# Altium project Main_Board.PrjPcb
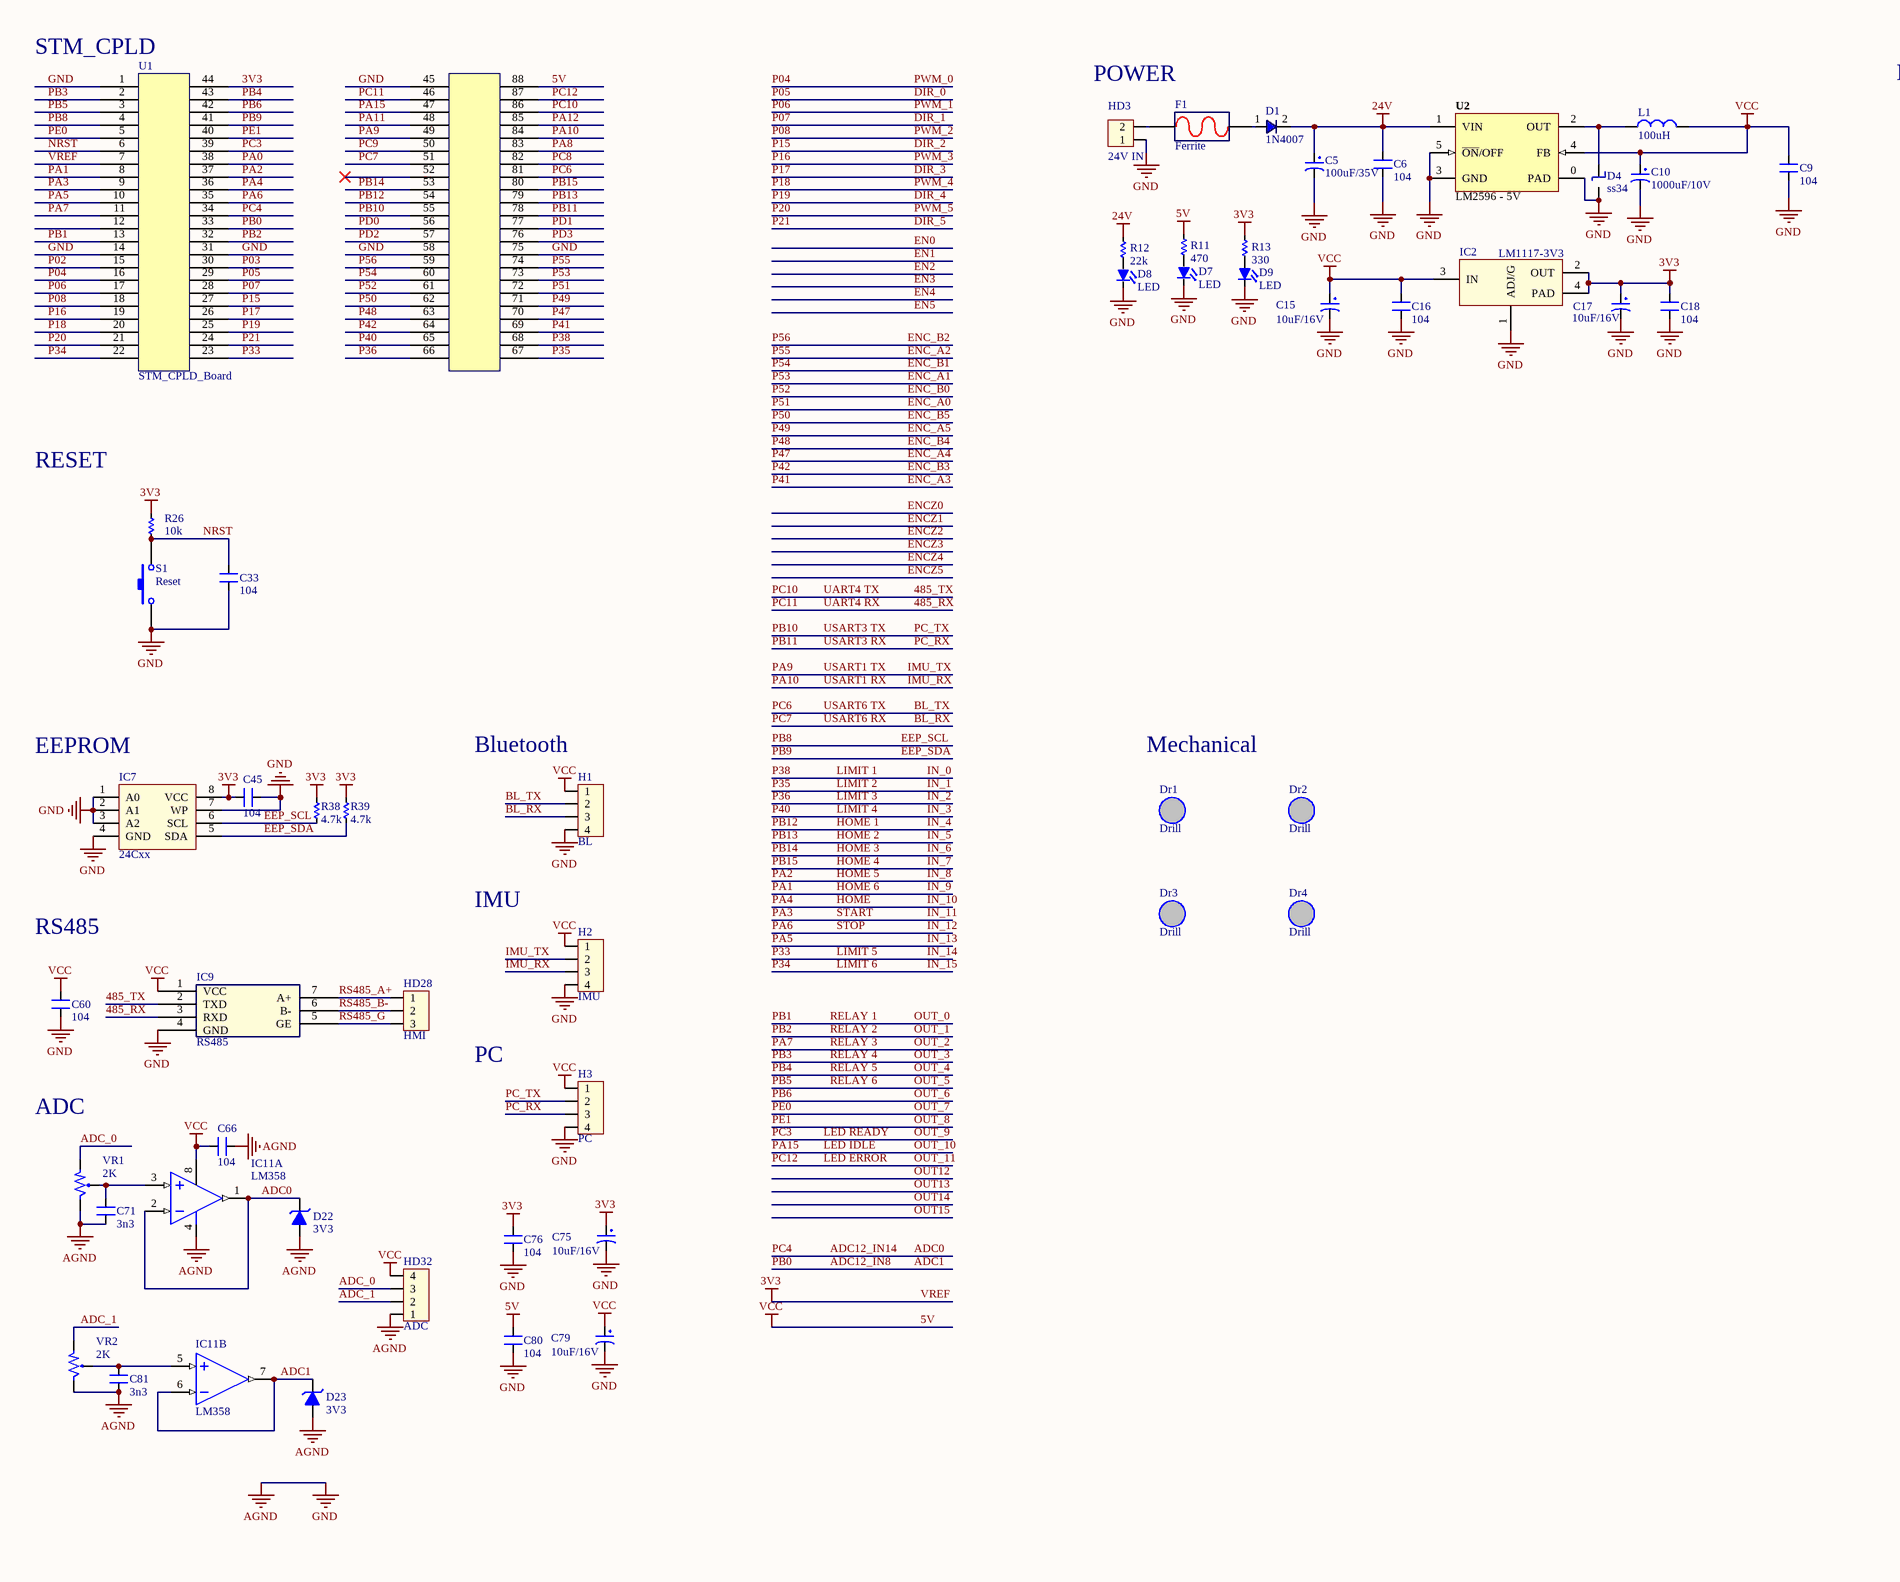
[diagram p0: Main_Board.SchDoc, top left]
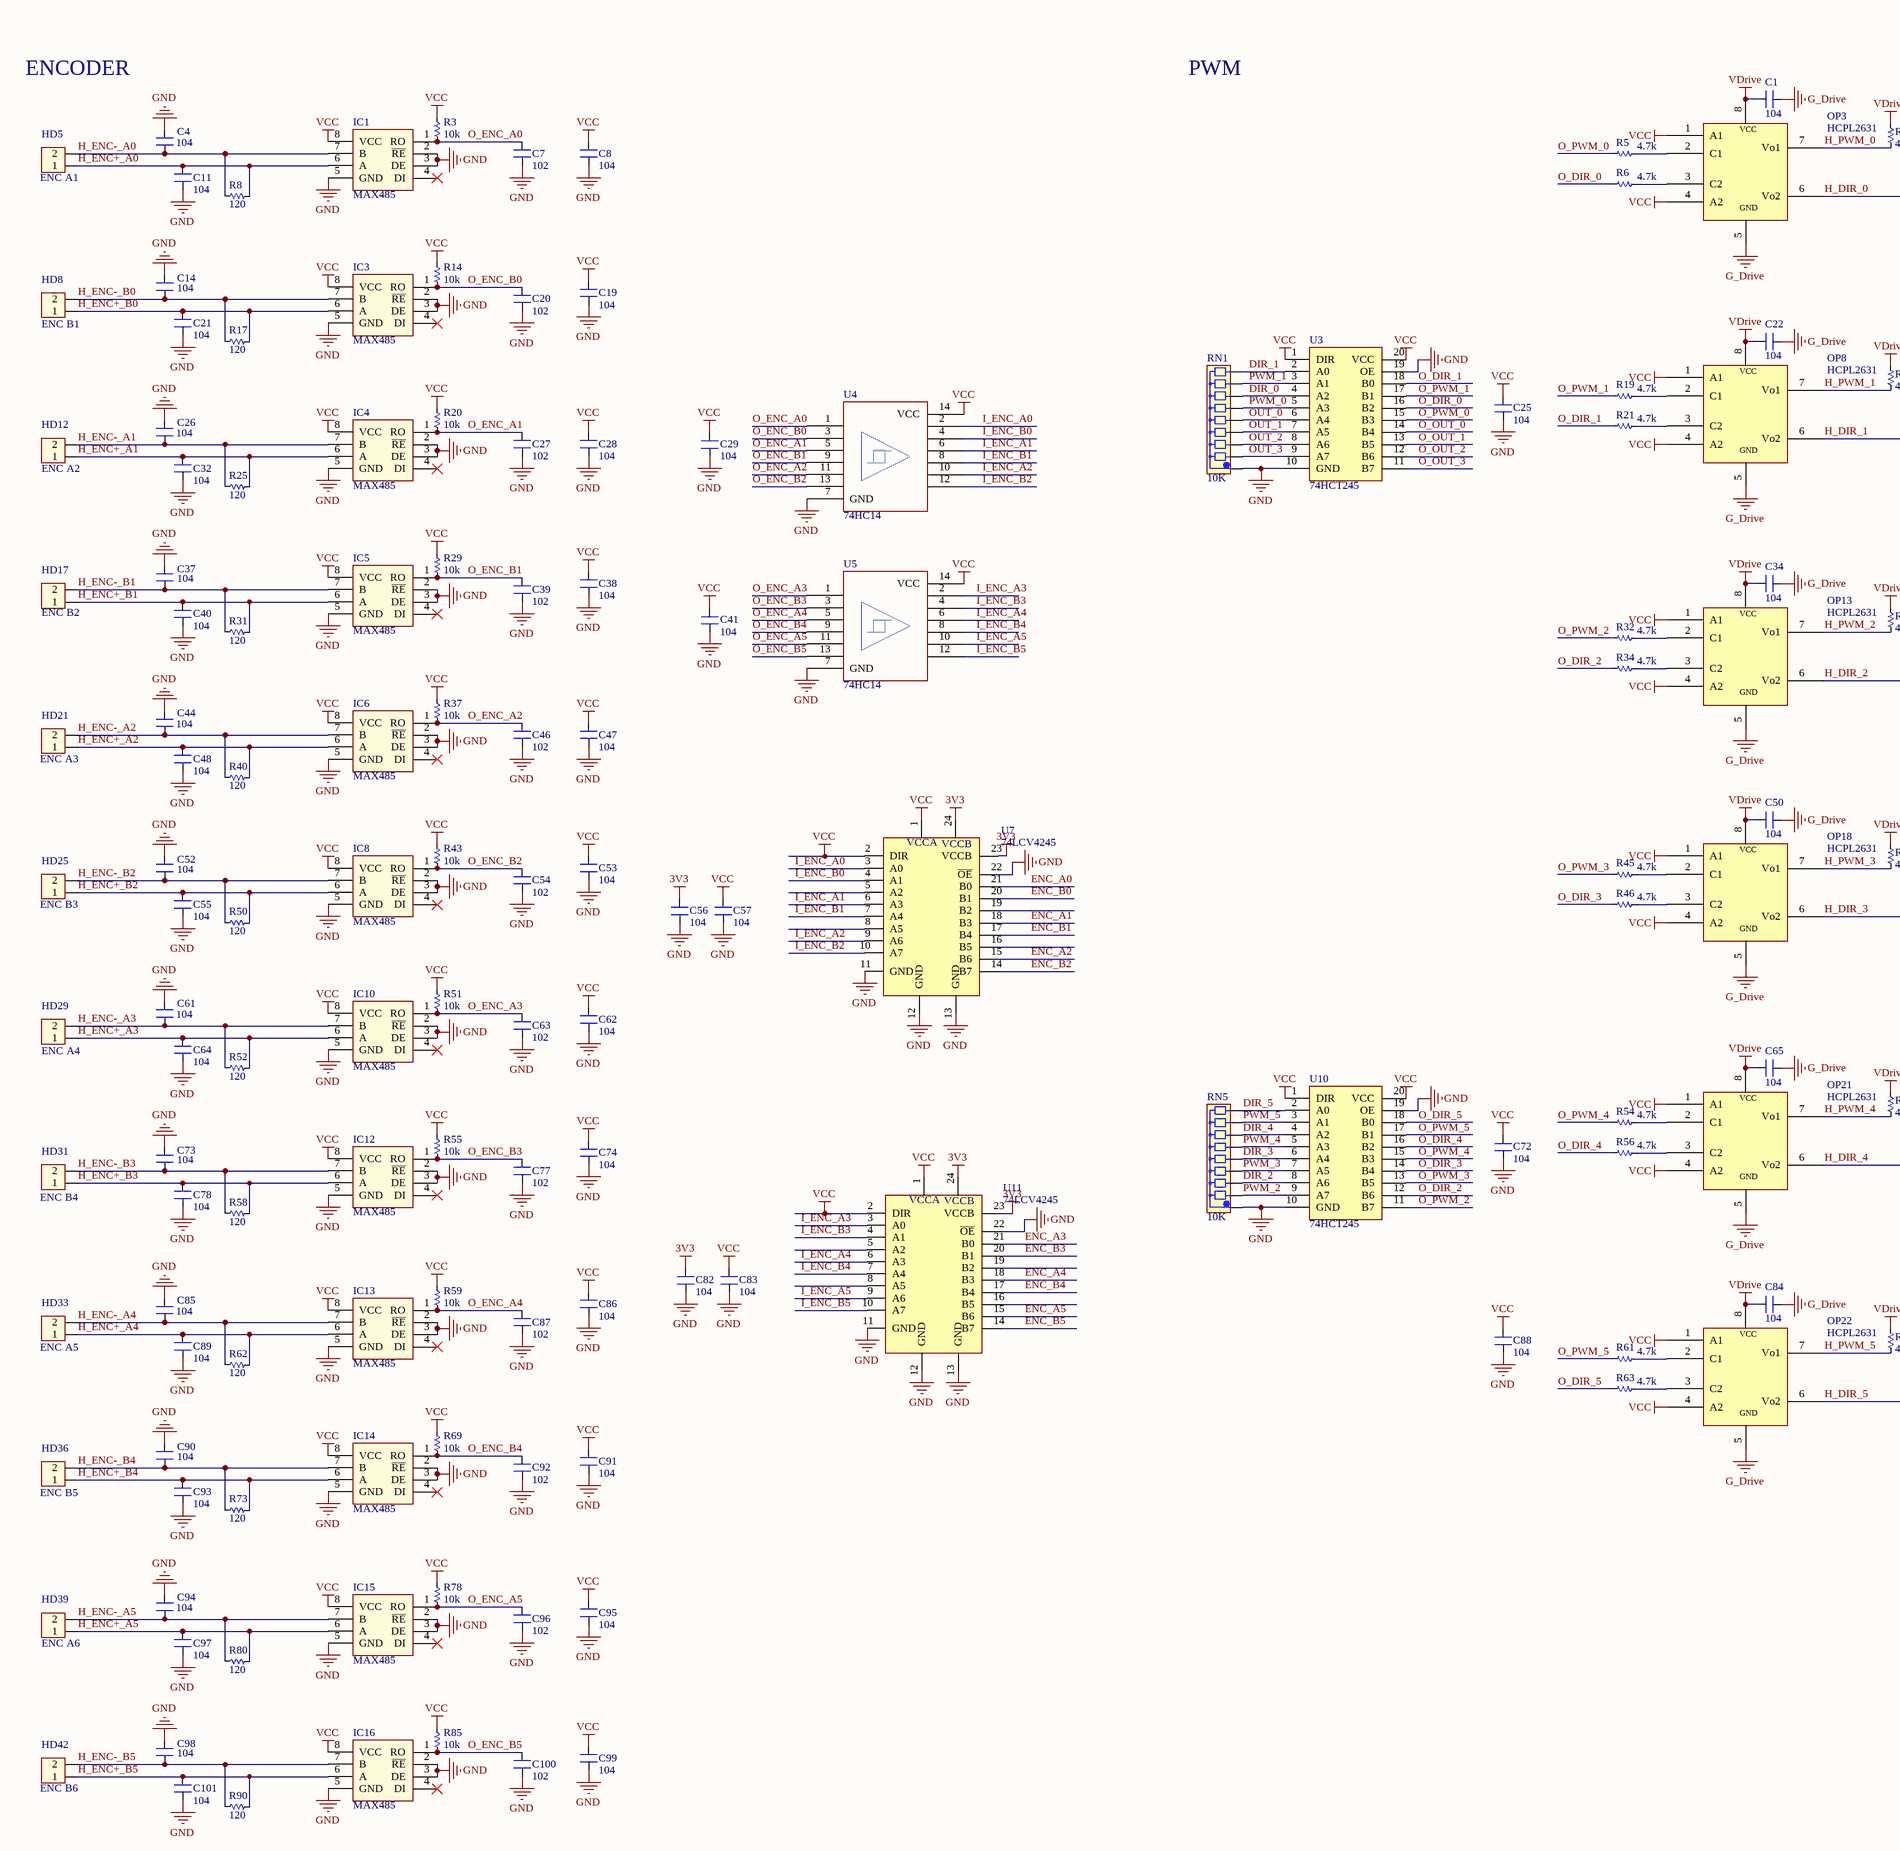
[diagram p1: Main_Board.SchDoc, top middle]
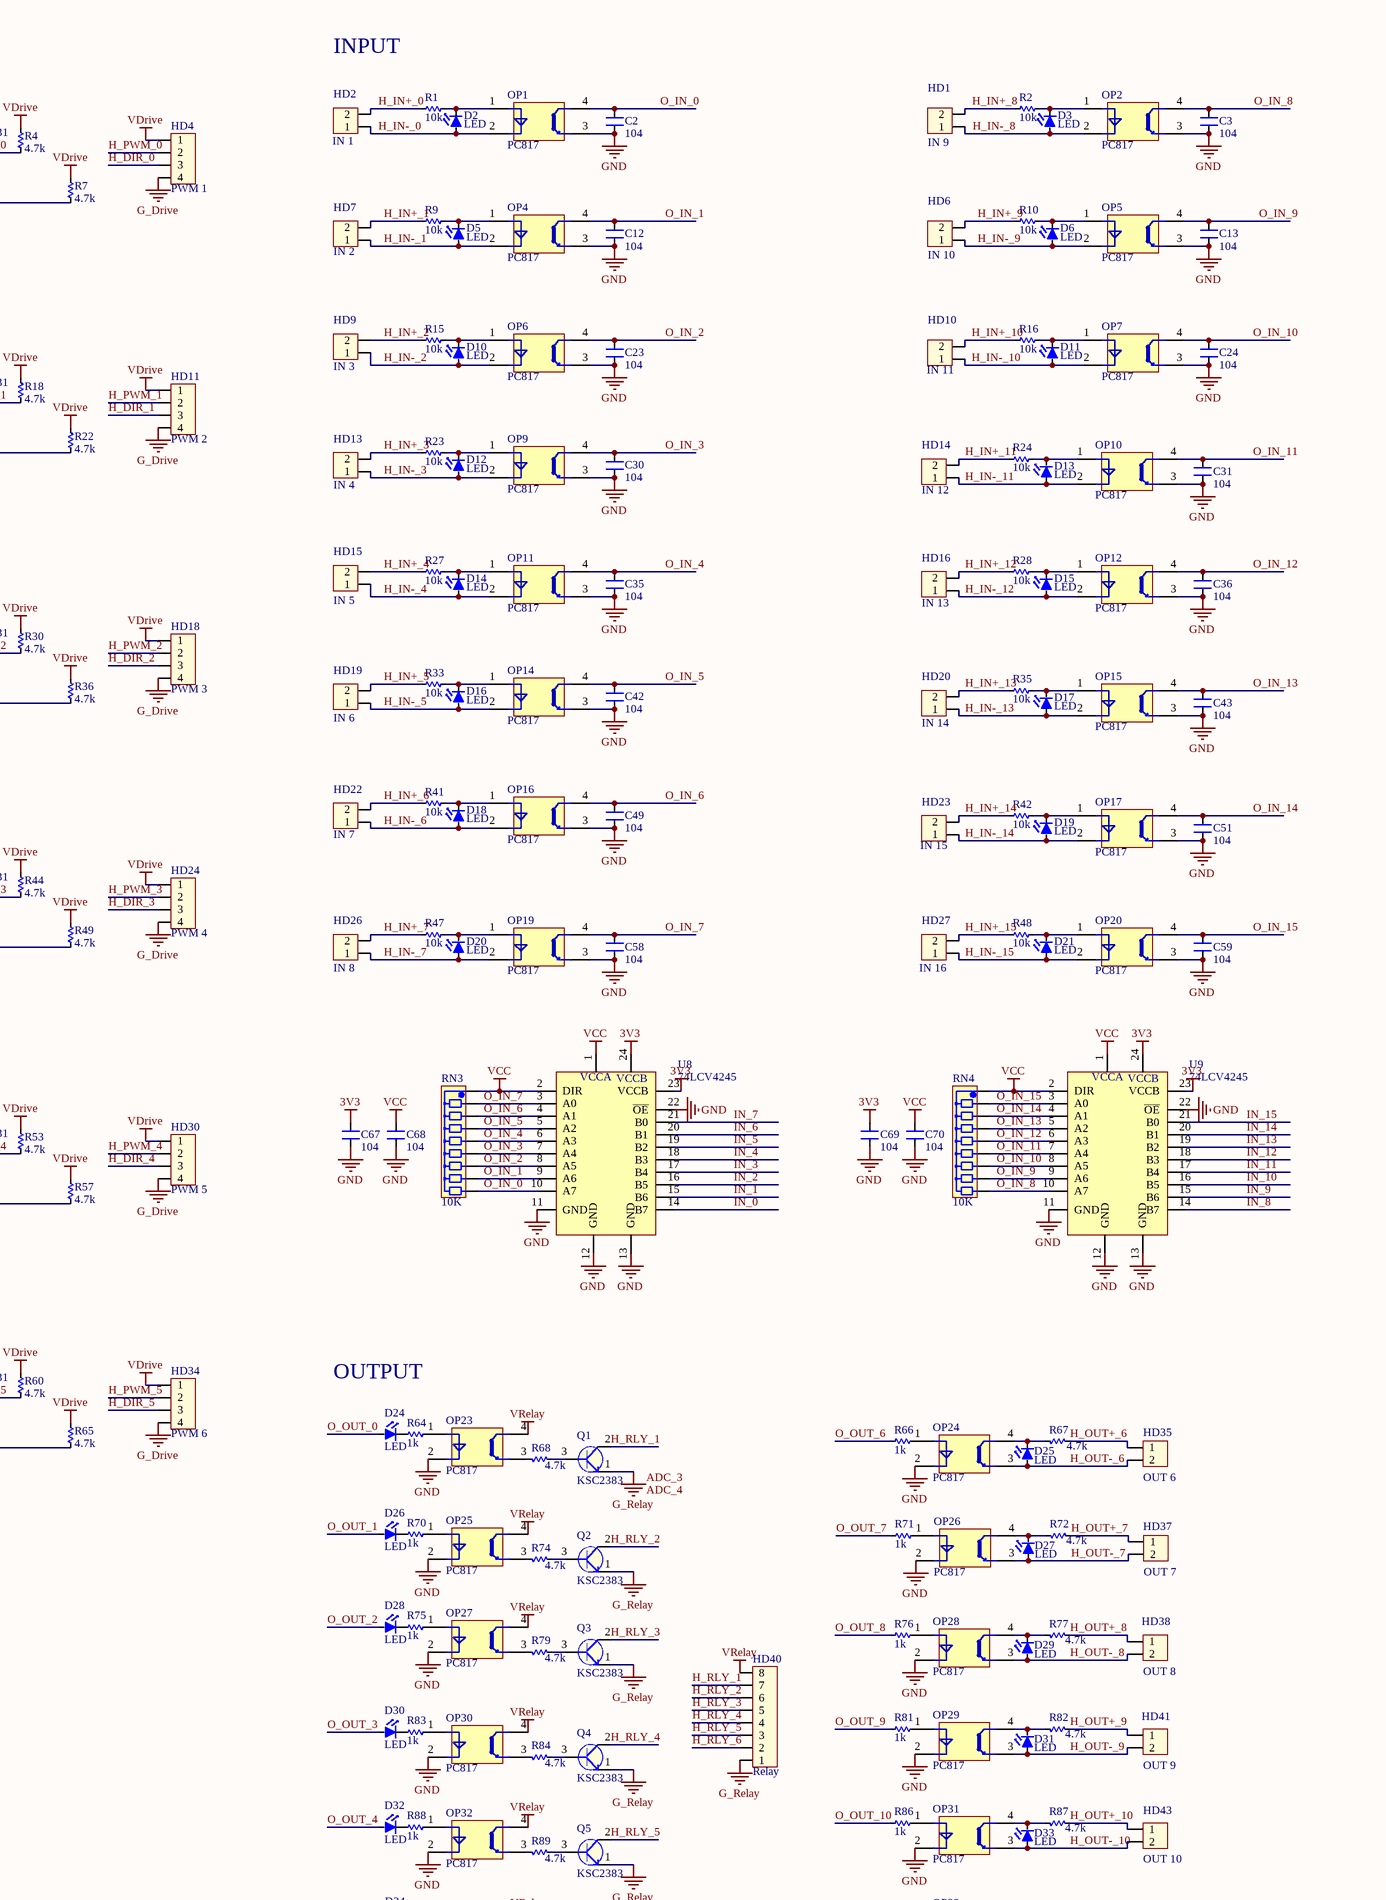
[diagram p2: Main_Board.SchDoc, top right]
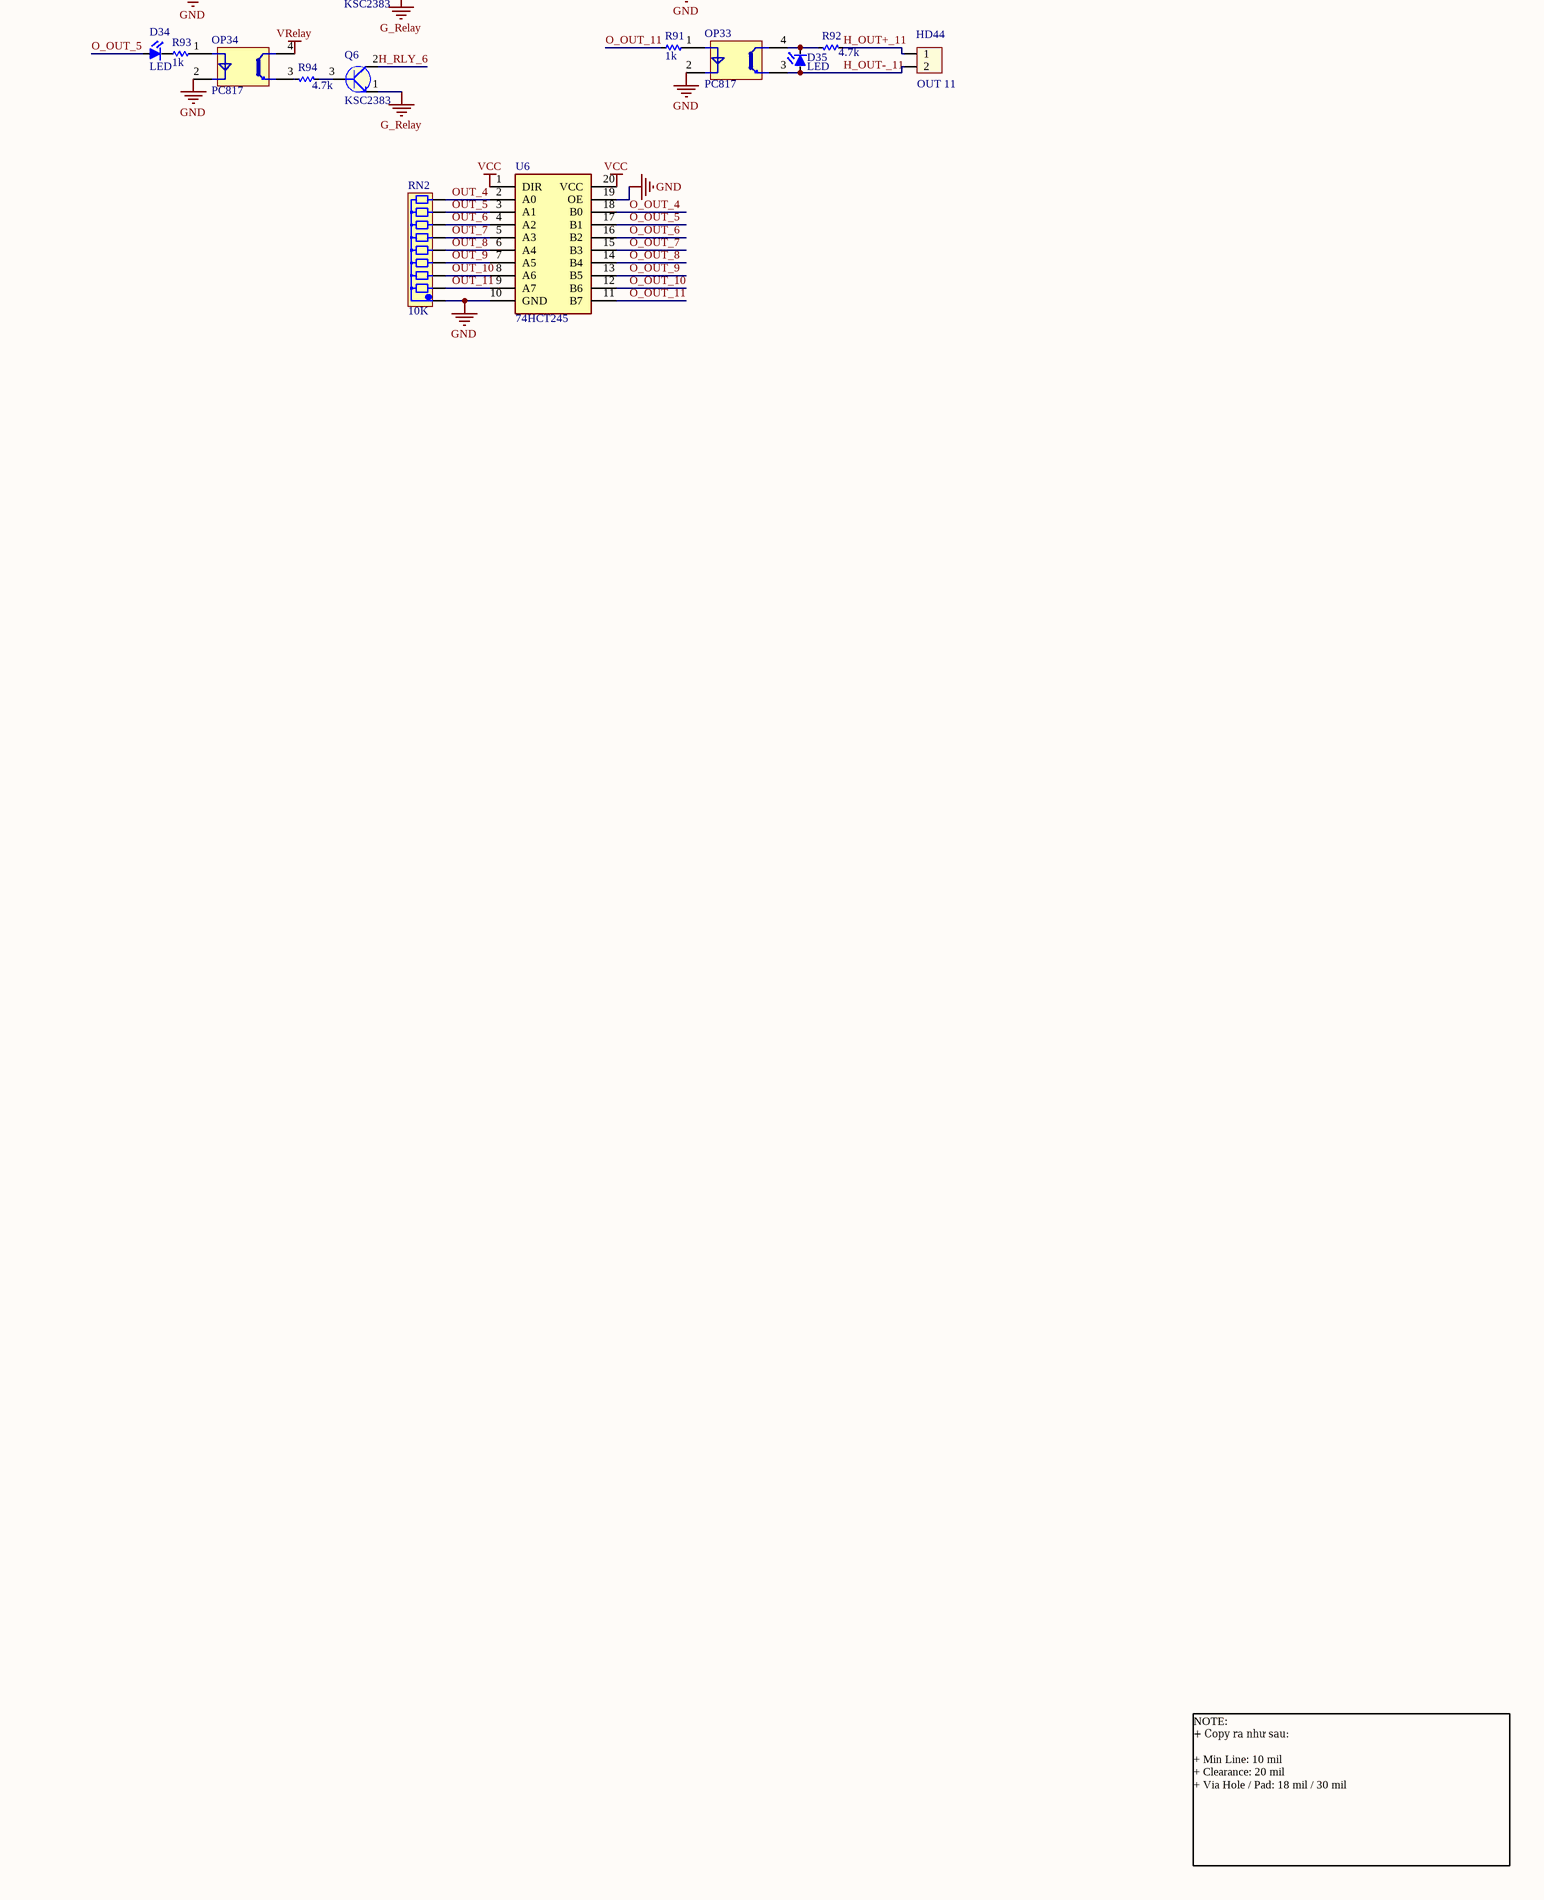
[diagram p3: Main_Board.SchDoc, bottom right]
1 sheet, 358 parts. Net scope: global (net labels, ports and power ports of the same name join across sheets).
Board file: Main_Board.PcbDoc

## Sheet Main_Board.SchDoc
size A0; Organization: Altium Limited; Address1: L3, 12a Rodborough Rd; Address2: Frenchs Forest; Address3: NSW; Address4: Australia 2086

### Parts
C1  104  [CAP-SM-0805]
C2  104  [CAP-SM-0805]
C3  104  [CAP-SM-0805]
C4  104  [CAP-SM-0805]
C5  100uF/35V  [Cap_Alu_D8]
C6  104  [CAP-SM-0805]
C7  102  [CAP-SM-0805]
C8  104  [CAP-SM-0805]
C9  104  [CAP-SM-0805]
C10  1000uF/10V  [Cap_Alu_G]
C11  104  [CAP-SM-0805]
C12  104  [CAP-SM-0805]
C13  104  [CAP-SM-0805]
C14  104  [CAP-SM-0805]
C15  10uF/16V  [CAP_ALU_B]
C16  104  [CAP-SM-0805]
C17  10uF/16V  [CAP_ALU_B]
C18  104  [CAP-SM-0805]
C19  104  [CAP-SM-0805]
C20  102  [CAP-SM-0805]
C21  104  [CAP-SM-0805]
C22  104  [CAP-SM-0805]
C23  104  [CAP-SM-0805]
C24  104  [CAP-SM-0805]
C25  104  [CAP-SM-0805]
C26  104  [CAP-SM-0805]
C27  102  [CAP-SM-0805]
C28  104  [CAP-SM-0805]
C29  104  [CAP-SM-0805]
C30  104  [CAP-SM-0805]
C31  104  [CAP-SM-0805]
C32  104  [CAP-SM-0805]
C33  104  [CAP-SM-0805]
C34  104  [CAP-SM-0805]
C35  104  [CAP-SM-0805]
C36  104  [CAP-SM-0805]
C37  104  [CAP-SM-0805]
C38  104  [CAP-SM-0805]
C39  102  [CAP-SM-0805]
C40  104  [CAP-SM-0805]
C41  104  [CAP-SM-0805]
C42  104  [CAP-SM-0805]
C43  104  [CAP-SM-0805]
C44  104  [CAP-SM-0805]
C45  104  [CAP-SM-0805]
C46  102  [CAP-SM-0805]
C47  104  [CAP-SM-0805]
C48  104  [CAP-SM-0805]
C49  104  [CAP-SM-0805]
C50  104  [CAP-SM-0805]
C51  104  [CAP-SM-0805]
C52  104  [CAP-SM-0805]
C53  104  [CAP-SM-0805]
C54  102  [CAP-SM-0805]
C55  104  [CAP-SM-0805]
C56  104  [CAP-SM-0805]
C57  104  [CAP-SM-0805]
C58  104  [CAP-SM-0805]
C59  104  [CAP-SM-0805]
C60  104  [CAP-SM-0805]
C61  104  [CAP-SM-0805]
C62  104  [CAP-SM-0805]
C63  102  [CAP-SM-0805]
C64  104  [CAP-SM-0805]
C65  104  [CAP-SM-0805]
C66  104  [CAP-SM-0805]
C67  104  [CAP-SM-0805]
C68  104  [CAP-SM-0805]
C69  104  [CAP-SM-0805]
C70  104  [CAP-SM-0805]
C71  3n3  [CAP-SM-0805]
C72  104  [CAP-SM-0805]
C73  104  [CAP-SM-0805]
C74  104  [CAP-SM-0805]
C75  10uF/16V  [CAP_ALU_B]
C76  104  [CAP-SM-0805]
C77  102  [CAP-SM-0805]
C78  104  [CAP-SM-0805]
C79  10uF/16V  [CAP_ALU_B]
C80  104  [CAP-SM-0805]
C81  3n3  [CAP-SM-0805]
C82  104  [CAP-SM-0805]
C83  104  [CAP-SM-0805]
C84  104  [CAP-SM-0805]
C85  104  [CAP-SM-0805]
C86  104  [CAP-SM-0805]
C87  102  [CAP-SM-0805]
C88  104  [CAP-SM-0805]
C89  104  [CAP-SM-0805]
C90  104  [CAP-SM-0805]
C91  104  [CAP-SM-0805]
C92  102  [CAP-SM-0805]
C93  104  [CAP-SM-0805]
C94  104  [CAP-SM-0805]
C95  104  [CAP-SM-0805]
C96  102  [CAP-SM-0805]
C97  104  [CAP-SM-0805]
C98  104  [CAP-SM-0805]
C99  104  [CAP-SM-0805]
C100  102  [CAP-SM-0805]
C101  104  [CAP-SM-0805]
D1  1N4007  [DO-214AB]
D2  LED  [LED_0805_Blue]
D3  LED  [LED_0805_Blue]
D4  ss34  [DO-214AB]
D5  LED  [LED_0805_Blue]
D6  LED  [LED_0805_Blue]
D7  LED  [LED_0805_Blue]
D8  LED  [LED_0805_Blue]
D9  LED  [LED_0805_Blue]
D10  LED  [LED_0805_Blue]
D11  LED  [LED_0805_Blue]
D12  LED  [LED_0805_Blue]
D13  LED  [LED_0805_Blue]
D14  LED  [LED_0805_Blue]
D15  LED  [LED_0805_Blue]
D16  LED  [LED_0805_Blue]
D17  LED  [LED_0805_Blue]
D18  LED  [LED_0805_Blue]
D19  LED  [LED_0805_Blue]
D20  LED  [LED_0805_Blue]
D21  LED  [LED_0805_Blue]
D22  3V3  [Diode zener]
D23  3V3  [Diode zener]
D24  LED  [LED_0805_Blue]
D25  LED  [LED_0805_Blue]
D26  LED  [LED_0805_Blue]
D27  LED  [LED_0805_Blue]
D28  LED  [LED_0805_Blue]
D29  LED  [LED_0805_Blue]
D30  LED  [LED_0805_Blue]
D31  LED  [LED_0805_Blue]
D32  LED  [LED_0805_Blue]
D33  LED  [LED_0805_Blue]
D34  LED  [LED_0805_Blue]
D35  LED  [LED_0805_Blue]
Dr1  Drill  [Drill 3mm]
Dr2  Drill  [Drill 3mm]
Dr3  Drill  [Drill 3mm]
Dr4  Drill  [Drill 3mm]
F1  Ferrite  [Ferrite]
H1  BL  [Header White 4]
H2  IMU  [Header White 4]
H3  PC  [Header White 4]
HD1  IN 9  [Domino 2]
HD2  IN 1  [Domino 2]
HD3  24V IN  [Domino 2]
HD4  PWM 1  [Domino 4]
HD5  ENC A1  [Domino 2]
HD6  IN 10  [Domino 2]
HD7  IN 2  [Domino 2]
HD8  ENC B1  [Domino 2]
HD9  IN 3  [Domino 2]
HD10  IN 11  [Domino 2]
HD11  PWM 2  [Domino 4]
HD12  ENC A2  [Domino 2]
HD13  IN 4  [Domino 2]
HD14  IN 12  [Domino 2]
HD15  IN 5  [Domino 2]
HD16  IN 13  [Domino 2]
HD17  ENC B2  [Domino 2]
HD18  PWM 3  [Domino 4]
HD19  IN 6  [Domino 2]
HD20  IN 14  [Domino 2]
HD21  ENC A3  [Domino 2]
HD22  IN 7  [Domino 2]
HD23  IN 15  [Domino 2]
HD24  PWM 4  [Domino 4]
HD25  ENC B3  [Domino 2]
HD26  IN 8  [Domino 2]
HD27  IN 16  [Domino 2]
HD28  HMI  [Domino 3]
HD29  ENC A4  [Domino 2]
HD30  PWM 5  [Domino 4]
HD31  ENC B4  [Domino 2]
HD32  ADC  [Domino 4]
HD33  ENC A5  [Domino 2]
HD34  PWM 6  [Domino 4]
HD35  OUT 6  [Domino 2]
HD36  ENC B5  [Domino 2]
HD37  OUT 7  [Domino 2]
HD38  OUT 8  [Domino 2]
HD39  ENC A6  [Domino 2]
HD40  Relay  [Domino 8]
HD41  OUT 9  [Domino 2]
HD42  ENC B6  [Domino 2]
HD43  OUT 10  [Domino 2]
HD44  OUT 11  [Domino 2]
IC1  MAX485  [SOIC8]
IC2  LM1117-3V3  [SOT223-4N]
IC3  MAX485  [SOIC8]
IC4  MAX485  [SOIC8]
IC5  MAX485  [SOIC8]
IC6  MAX485  [SOIC8]
IC7  24Cxx  [SOIC8]
IC8  MAX485  [SOIC8]
IC9  RS485  [RS485_Module]
IC10  MAX485  [SOIC8]
IC11  LM358  [SO8-200mil]  (parts A,B of 2)
IC12  MAX485  [SOIC8]
IC13  MAX485  [SOIC8]
IC14  MAX485  [SOIC8]
IC15  MAX485  [SOIC8]
IC16  MAX485  [SOIC8]
L1  100uH  [INDUCTOR_SMD]
OP1  PC817  [SOP4 2.54]
OP2  PC817  [SOP4 2.54]
OP3  HCPL2631  [6N137SMD]
OP4  PC817  [SOP4 2.54]
OP5  PC817  [SOP4 2.54]
OP6  PC817  [SOP4 2.54]
OP7  PC817  [SOP4 2.54]
OP8  HCPL2631  [6N137SMD]
OP9  PC817  [SOP4 2.54]
OP10  PC817  [SOP4 2.54]
OP11  PC817  [SOP4 2.54]
OP12  PC817  [SOP4 2.54]
OP13  HCPL2631  [6N137SMD]
OP14  PC817  [SOP4 2.54]
OP15  PC817  [SOP4 2.54]
OP16  PC817  [SOP4 2.54]
OP17  PC817  [SOP4 2.54]
OP18  HCPL2631  [6N137SMD]
OP19  PC817  [SOP4 2.54]
OP20  PC817  [SOP4 2.54]
OP21  HCPL2631  [6N137SMD]
OP22  HCPL2631  [6N137SMD]
OP23  PC817  [SOP4 2.54]
OP24  PC817  [SOP4 2.54]
OP25  PC817  [SOP4 2.54]
OP26  PC817  [SOP4 2.54]
OP27  PC817  [SOP4 2.54]
OP28  PC817  [SOP4 2.54]
OP29  PC817  [SOP4 2.54]
OP30  PC817  [SOP4 2.54]
OP31  PC817  [SOP4 2.54]
OP32  PC817  [SOP4 2.54]
OP33  PC817  [SOP4 2.54]
OP34  PC817  [SOP4 2.54]
Q1  KSC2383  [To-92a]
Q2  KSC2383  [To-92a]
Q3  KSC2383  [To-92a]
Q4  KSC2383  [To-92a]
Q5  KSC2383  [To-92a]
Q6  KSC2383  [To-92a]
R1  10k  [RES-SM-0805]
R2  10k  [RES-SM-0805]
R3  10k  [RES-SM-0805]
R4  4.7k  [RES-SM-0805]
R5  4.7k  [RES-SM-0805]
R6  4.7k  [RES-SM-0805]
R7  4.7k  [RES-SM-0805]
R8  120  [RES-SM-0805]
R9  10k  [RES-SM-0805]
R10  10k  [RES-SM-0805]
R11  470  [RES-SM-0805]
R12  22k  [RES-SM-0805]
R13  330  [RES-SM-0805]
R14  10k  [RES-SM-0805]
R15  10k  [RES-SM-0805]
R16  10k  [RES-SM-0805]
R17  120  [RES-SM-0805]
R18  4.7k  [RES-SM-0805]
R19  4.7k  [RES-SM-0805]
R20  10k  [RES-SM-0805]
R21  4.7k  [RES-SM-0805]
R22  4.7k  [RES-SM-0805]
R23  10k  [RES-SM-0805]
R24  10k  [RES-SM-0805]
R25  120  [RES-SM-0805]
R26  10k  [RES-SM-0805]
R27  10k  [RES-SM-0805]
R28  10k  [RES-SM-0805]
R29  10k  [RES-SM-0805]
R30  4.7k  [RES-SM-0805]
R31  120  [RES-SM-0805]
R32  4.7k  [RES-SM-0805]
R33  10k  [RES-SM-0805]
R34  4.7k  [RES-SM-0805]
R35  10k  [RES-SM-0805]
R36  4.7k  [RES-SM-0805]
R37  10k  [RES-SM-0805]
R38  4.7k  [RES-SM-0805]
R39  4.7k  [RES-SM-0805]
R40  120  [RES-SM-0805]
R41  10k  [RES-SM-0805]
R42  10k  [RES-SM-0805]
R43  10k  [RES-SM-0805]
R44  4.7k  [RES-SM-0805]
R45  4.7k  [RES-SM-0805]
R46  4.7k  [RES-SM-0805]
R47  10k  [RES-SM-0805]
R48  10k  [RES-SM-0805]
R49  4.7k  [RES-SM-0805]
R50  120  [RES-SM-0805]
R51  10k  [RES-SM-0805]
R52  120  [RES-SM-0805]
R53  4.7k  [RES-SM-0805]
R54  4.7k  [RES-SM-0805]
R55  10k  [RES-SM-0805]
R56  4.7k  [RES-SM-0805]
R57  4.7k  [RES-SM-0805]
R58  120  [RES-SM-0805]
R59  10k  [RES-SM-0805]
R60  4.7k  [RES-SM-0805]
R61  4.7k  [RES-SM-0805]
R62  120  [RES-SM-0805]
R63  4.7k  [RES-SM-0805]
R64  1k  [RES-SM-0805]
R65  4.7k  [RES-SM-0805]
R66  1k  [RES-SM-0805]
R67  4.7k  [RES-SM-0805]
R68  4.7k  [RES-SM-0805]
R69  10k  [RES-SM-0805]
R70  1k  [RES-SM-0805]
R71  1k  [RES-SM-0805]
R72  4.7k  [RES-SM-0805]
R73  120  [RES-SM-0805]
R74  4.7k  [RES-SM-0805]
R75  1k  [RES-SM-0805]
R76  1k  [RES-SM-0805]
R77  4.7k  [RES-SM-0805]
R78  10k  [RES-SM-0805]
R79  4.7k  [RES-SM-0805]
R80  120  [RES-SM-0805]
R81  1k  [RES-SM-0805]
R82  4.7k  [RES-SM-0805]
R83  1k  [RES-SM-0805]
R84  4.7k  [RES-SM-0805]
R85  10k  [RES-SM-0805]
R86  1k  [RES-SM-0805]
R87  4.7k  [RES-SM-0805]
R88  1k  [RES-SM-0805]
R89  4.7k  [RES-SM-0805]
R90  120  [RES-SM-0805]
R91  1k  [RES-SM-0805]
R92  4.7k  [RES-SM-0805]
R93  1k  [RES-SM-0805]
R94  4.7k  [RES-SM-0805]
RN1  10K  [RN8]
RN2  10K  [RN8]
RN3  10K  [RN8]
RN4  10K  [RN8]
RN5  10K  [RN8]
S1  Reset  [SW2]
U1  STM_CPLD_Board  [STM_CPLD_Board]
U2  LM2596 - 5V  [TO263]
U3  74HCT245  [soic20]
U4  74HC14  [SOIC14]
U5  74HC14  [SOIC14]
U6  74HCT245  [soic20]
U7  74LCV4245  [SOIC24 - wide]
U8  74LCV4245  [SOIC24 - wide]
U9  74LCV4245  [SOIC24 - wide]
U10  74HCT245  [soic20]
U11  74LCV4245  [SOIC24 - wide]
VR1  2K  [VR1]
VR2  2K  [VR1]

### Nets
3V3: C17.1 C18.1 C45.2 C56.2 C67.2 C69.2 C75.1 C76.1 C82.2 IC2.2(OUT) IC2.4(PAD) IC7.8(VCC) R13.1 R26.1 R38.2 R39.1 U1.7 U1.44 U7.23(VCCB) U7.24(VCC(B)) U8.23(VCCB) U8.24(VCC(B)) U9.23(VCCB) U9.24(VCC(B)) U11.23(VCCB) U11.24(VCC(B))  [also labelled VREF]
5V: C8.1 C9.2 C10.1 C15.1 C16.1 C19.1 C25.2 C28.1 C29.2 C38.1 C41.2 C47.1 C53.1 C57.2 C60.1 C62.1 C66.1 C68.2 C70.2 C72.2 C74.1 C79.1 C80.1 C83.2 C86.1 C88.2 C91.1 C95.1 C99.1 H1.1 H2.1 H3.1 HD32.4 IC1.8(VCC) IC2.3(IN) IC3.8(VCC) IC4.8(VCC) IC5.8(VCC) IC6.8(VCC) IC8.8(VCC) IC9.1(VCC) IC10.8(VCC) IC11.8(+V) IC12.8(VCC) IC13.8(VCC) IC14.8(VCC) IC15.8(VCC) IC16.8(VCC) L1.2 OP3.1(A1) OP3.4(A2) OP8.1(A1) OP8.4(A2) OP13.1(A1) OP13.4(A2) OP18.1(A1) OP18.4(A2) OP21.1(A1) OP21.4(A2) OP22.1(A1) OP22.4(A2) R3.1 R11.1 R14.1 R20.1 R29.1 R37.1 R43.1 R51.1 R55.1 R59.1 R69.1 R78.1 R85.1 RN3.1 RN4.1 U1.88 U2.4(FB) U3.1(DIR) U3.20(VCC) U4.14(VCC) U5.14(VCC) U6.1(DIR) U6.20(VCC) U7.1(VCC(A)) U7.2(DIR) U8.1(VCC(A)) U8.2(DIR) U9.1(VCC(A)) U9.2(DIR) U10.1(DIR) U10.20(VCC) U11.1(VCC(A)) U11.2(DIR)  [also labelled VCC]
24V: C5.1 C6.1 D1.2 R12.1 U2.1(VIN)
G_Drive: C1.1 C22.1 C34.1 C50.1 C65.1 C84.1 HD4.4 HD11.4 HD18.4 HD24.4 HD30.4 HD34.4 OP3.5(GND) OP8.5(GND) OP13.5(GND) OP18.5(GND) OP21.5(GND) OP22.5(GND)
G_Relay: HD40.1 Q1.1(E) Q2.1(E) Q3.1(E) Q4.1(E) Q5.1(E) Q6.1(E)
GND: C2.1 C3.1 C4.1 C5.2 C6.2 C7.2 C8.2 C9.1 C10.2 C11.2 C12.1 C13.1 C14.1 C15.2 C16.2 C17.2 C18.2 C19.2 C20.2 C21.2 C23.1 C24.1 C25.1 C26.1 C27.2 C28.2 C29.1 C30.1 C31.1 C32.2 C33.2 C35.1 C36.1 C37.1 C38.2 C39.2 C40.2 C41.1 C42.1 C43.1 C44.1 C45.1 C46.2 C47.2 C48.2 C49.1 C51.1 C52.1 C53.2 C54.2 C55.2 C56.1 C57.1 C58.1 C59.1 C60.2 C61.1 C62.2 C63.2 C64.2 C66.2 C67.1 C68.1 C69.1 C70.1 C71.1 C72.1 C73.1 C74.2 C75.2 C76.2 C77.2 C78.2 C79.2 C80.2 C81.1 C82.1 C83.1 C85.1 C86.2 C87.2 C88.1 C89.2 C90.1 C91.2 C92.2 C93.2 C94.1 C95.2 C96.2 C97.2 C98.1 C99.2 C100.2 C101.2 D4.2(B) D7.2(K) D8.2(K) D9.2(K) D22.1(A) D23.1(A) H1.4 H2.4 H3.4 HD3.1 HD32.1 IC1.2(~{RE}) IC1.3(DE) IC1.5(GND) IC2.1(ADJ/G) IC3.2(~{RE}) IC3.3(DE) IC3.5(GND) IC4.2(~{RE}) IC4.3(DE) IC4.5(GND) IC5.2(~{RE}) IC5.3(DE) IC5.5(GND) IC6.2(~{RE}) IC6.3(DE) IC6.5(GND) IC7.1(A0) IC7.2(A1) IC7.3(A2) IC7.4(GND) IC7.7(WP) IC8.2(~{RE}) IC8.3(DE) IC8.5(GND) IC9.4(GND) IC10.2(~{RE}) IC10.3(DE) IC10.5(GND) IC11.4(-V) IC12.2(~{RE}) IC12.3(DE) IC12.5(GND) IC13.2(~{RE}) IC13.3(DE) IC13.5(GND) IC14.2(~{RE}) IC14.3(DE) IC14.5(GND) IC15.2(~{RE}) IC15.3(DE) IC15.5(GND) IC16.2(~{RE}) IC16.3(DE) IC16.5(GND) OP1.3(C) OP2.3(C) OP4.3(C) OP5.3(C) OP6.3(C) OP7.3(C) OP9.3(C) OP10.3(C) OP11.3(C) OP12.3(C) OP14.3(C) OP15.3(C) OP16.3(C) OP17.3(C) OP19.3(C) OP20.3(C) OP23.2(C) OP24.2(C) OP25.2(C) OP26.2(C) OP27.2(C) OP28.2(C) OP29.2(C) OP30.2(C) OP31.2(C) OP32.2(C) OP33.2(C) OP34.2(C) RN1.1 RN2.1 RN5.1 S1.1 U1.1 U1.14 U1.31 U1.45 U1.58 U1.75 U2.0(PAD) U2.3(GND) U2.5(~{ON}/OFF) U3.10(GND) U3.19(OE) U4.7(GND) U5.7(GND) U6.10(GND) U6.19(OE) U7.11(GND) U7.12(GND) U7.13(GND) U7.22(~{OE}) U8.11(GND) U8.12(GND) U8.13(GND) U8.22(~{OE}) U9.11(GND) U9.12(GND) U9.13(GND) U9.22(~{OE}) U10.10(GND) U10.19(OE) U11.11(GND) U11.12(GND) U11.13(GND) U11.22(~{OE}) VR1.3 VR2.3  [also labelled AGND]
VDrive: C1.2 C22.2 C34.2 C50.2 C65.2 C84.2 HD4.1 HD11.1 HD18.1 HD24.1 HD30.1 HD34.1 OP3.8(VCC) OP8.8(VCC) OP13.8(VCC) OP18.8(VCC) OP21.8(VCC) OP22.8(VCC) R4.1 R7.1 R18.1 R22.1 R30.1 R36.1 R44.1 R49.1 R53.1 R57.1 R60.1 R65.1
VRelay: HD40.8 OP23.4(E) OP25.4(E) OP27.4(E) OP30.4(E) OP32.4(E) OP34.4(E)
485_RX: IC9.3(RXD) U1.46  [also labelled PC11, UART4 RX]
485_TX: IC9.2(TXD) U1.86  [also labelled PC10, UART4 TX]
ADC0: D22.2(K) IC11.1(OUT) IC11.2(IN-) U1.34  [also labelled ADC12_IN14, PC4]
ADC1: D23.2(K) IC11.6(IN-) IC11.7(OUT) U1.33  [also labelled ADC12_IN8, PB0]
ADC_0: HD32.3 VR1.1
ADC_1: HD32.2 VR2.1
BL_RX: H1.3 U1.51  [also labelled PC7, USART6 RX]
BL_TX: H1.2 U1.81  [also labelled PC6, USART6 TX]
DIR_0: RN1.7 U1.29 U3.4(A2)  [also labelled P05]
DIR_1: RN1.9 U1.28 U3.2(A0)  [also labelled P07]
DIR_2: RN5.3 U1.27 U10.8(A6)  [also labelled P15]
DIR_3: RN5.5 U1.26 U10.6(A4)  [also labelled P17]
DIR_4: RN5.7 U1.25 U10.4(A2)  [also labelled P19]
DIR_5: RN5.9 U1.24 U10.2(A0)  [also labelled P21]
EEP_SCL: IC7.6(SCL) R38.1 U1.4  [also labelled PB8]
EEP_SDA: IC7.5(SDA) R39.2 U1.41  [also labelled PB9]
ENC_A0: U1.72 U7.21(B0)  [also labelled P51]
ENC_A1: U1.73 U7.18(B3)  [also labelled P53]
ENC_A2: U1.74 U7.15(B6)  [also labelled P55]
ENC_A3: U1.69 U11.21(B0)  [also labelled P41]
ENC_A4: U1.70 U11.18(B3)  [also labelled P47]
ENC_A5: U1.71 U11.15(B6)  [also labelled P49]
ENC_B0: U1.61 U7.20(B1)  [also labelled P52]
ENC_B1: U1.60 U7.17(B4)  [also labelled P54]
ENC_B2: U1.59 U7.14(B7)  [also labelled P56]
ENC_B3: U1.64 U11.20(B1)  [also labelled P42]
ENC_B4: U1.63 U11.17(B4)  [also labelled P48]
ENC_B5: U1.62 U11.14(B7)  [also labelled P50]
H_DIR_0: HD4.3 OP3.6(Vo2) R7.2
H_DIR_1: HD11.3 OP8.6(Vo2) R22.2
H_DIR_2: HD18.3 OP13.6(Vo2) R36.2
H_DIR_3: HD24.3 OP18.6(Vo2) R49.2
H_DIR_4: HD30.3 OP21.6(Vo2) R57.2
H_DIR_5: HD34.3 OP22.6(Vo2) R65.2
H_ENC+_A0: C11.1 HD5.1 IC1.6(A) R8.1
H_ENC+_A1: C32.1 HD12.1 IC4.6(A) R25.1
H_ENC+_A2: C48.1 HD21.1 IC6.6(A) R40.1
H_ENC+_A3: C64.1 HD29.1 IC10.6(A) R52.1
H_ENC+_A4: C89.1 HD33.1 IC13.6(A) R62.1
H_ENC+_A5: C97.1 HD39.1 IC15.6(A) R80.1
H_ENC+_B0: C21.1 HD8.1 IC3.6(A) R17.1
H_ENC+_B1: C40.1 HD17.1 IC5.6(A) R31.1
H_ENC+_B2: C55.1 HD25.1 IC8.6(A) R50.1
H_ENC+_B3: C78.1 HD31.1 IC12.6(A) R58.1
H_ENC+_B4: C93.1 HD36.1 IC14.6(A) R73.1
H_ENC+_B5: C101.1 HD42.1 IC16.6(A) R90.1
H_ENC-_A0: C4.2 HD5.2 IC1.7(B) R8.2
H_ENC-_A1: C26.2 HD12.2 IC4.7(B) R25.2
H_ENC-_A2: C44.2 HD21.2 IC6.7(B) R40.2
H_ENC-_A3: C61.2 HD29.2 IC10.7(B) R52.2
H_ENC-_A4: C85.2 HD33.2 IC13.7(B) R62.2
H_ENC-_A5: C94.2 HD39.2 IC15.7(B) R80.2
H_ENC-_B0: C14.2 HD8.2 IC3.7(B) R17.2
H_ENC-_B1: C37.2 HD17.2 IC5.7(B) R31.2
H_ENC-_B2: C52.2 HD25.2 IC8.7(B) R50.2
H_ENC-_B3: C73.2 HD31.2 IC12.7(B) R58.2
H_ENC-_B4: C90.2 HD36.2 IC14.7(B) R73.2
H_ENC-_B5: C98.2 HD42.2 IC16.7(B) R90.2
H_IN+_0: HD2.2 R1.2
H_IN+_1: HD7.2 R9.2
H_IN+_2: HD9.2 R15.2
H_IN+_3: HD13.2 R23.2
H_IN+_4: HD15.2 R27.2
H_IN+_5: HD19.2 R33.2
H_IN+_6: HD22.2 R41.2
H_IN+_7: HD26.2 R47.2
H_IN+_8: HD1.2 R2.2
H_IN+_9: HD6.2 R10.2
H_IN+_10: HD10.2 R16.2
H_IN+_11: HD14.2 R24.2
H_IN+_12: HD16.2 R28.2
H_IN+_13: HD20.2 R35.2
H_IN+_14: HD23.2 R42.2
H_IN+_15: HD27.2 R48.2
H_IN-_0: D2.1(A) HD2.1 OP1.2(C)
H_IN-_1: D5.1(A) HD7.1 OP4.2(C)
H_IN-_2: D10.1(A) HD9.1 OP6.2(C)
H_IN-_3: D12.1(A) HD13.1 OP9.2(C)
H_IN-_4: D14.1(A) HD15.1 OP11.2(C)
H_IN-_5: D16.1(A) HD19.1 OP14.2(C)
H_IN-_6: D18.1(A) HD22.1 OP16.2(C)
H_IN-_7: D20.1(A) HD26.1 OP19.2(C)
H_IN-_8: D3.1(A) HD1.1 OP2.2(C)
H_IN-_9: D6.1(A) HD6.1 OP5.2(C)
H_IN-_10: D11.1(A) HD10.1 OP7.2(C)
H_IN-_11: D13.1(A) HD14.1 OP10.2(C)
H_IN-_12: D15.1(A) HD16.1 OP12.2(C)
H_IN-_13: D17.1(A) HD20.1 OP15.2(C)
H_IN-_14: D19.1(A) HD23.1 OP17.2(C)
H_IN-_15: D21.1(A) HD27.1 OP20.2(C)
H_OUT+_6: HD35.1 R67.2
H_OUT+_7: HD37.1 R72.2
H_OUT+_8: HD38.1 R77.2
H_OUT+_9: HD41.1 R82.2
H_OUT+_10: HD43.1 R87.2
H_OUT+_11: HD44.1 R92.2
H_OUT-_6: D25.1(A) HD35.2 OP24.3(C)
H_OUT-_7: D27.1(A) HD37.2 OP26.3(C)
H_OUT-_8: D29.1(A) HD38.2 OP28.3(C)
H_OUT-_9: D31.1(A) HD41.2 OP29.3(C)
H_OUT-_10: D33.1(A) HD43.2 OP31.3(C)
H_OUT-_11: D35.1(A) HD44.2 OP33.3(C)
H_PWM_0: HD4.2 OP3.7(Vo1) R4.2
H_PWM_1: HD11.2 OP8.7(Vo1) R18.2
H_PWM_2: HD18.2 OP13.7(Vo1) R30.2
H_PWM_3: HD24.2 OP18.7(Vo1) R44.2
H_PWM_4: HD30.2 OP21.7(Vo1) R53.2
H_PWM_5: HD34.2 OP22.7(Vo1) R60.2
H_RLY_1: HD40.7 Q1.2(E)
H_RLY_2: HD40.6 Q2.2(E)
H_RLY_3: HD40.5 Q3.2(E)
H_RLY_4: HD40.4 Q4.2(E)
H_RLY_5: HD40.3 Q5.2(E)
H_RLY_6: HD40.2 Q6.2(E)
HOME: U1.36 U9.16(B5)  [also labelled IN_10, PA4]
HOME 1: U1.54 U8.18(B3)  [also labelled IN_4, PB12]
HOME 2: U1.79 U8.19(B2)  [also labelled IN_5, PB13]
HOME 3: U1.53 U8.20(B1)  [also labelled IN_6, PB14]
HOME 4: U1.80 U8.21(B0)  [also labelled IN_7, PB15]
HOME 5: U1.37 U9.14(B7)  [also labelled IN_8, PA2]
HOME 6: U1.8 U9.15(B6)  [also labelled IN_9, PA1]
I_ENC_A0: U4.2 U7.3(A0)
I_ENC_A1: U4.6 U7.6(A3)
I_ENC_A2: U4.10 U7.9(A6)
I_ENC_A3: U5.2 U11.3(A0)
I_ENC_A4: U5.6 U11.6(A3)
I_ENC_A5: U5.10 U11.9(A6)
I_ENC_B0: U4.4 U7.4(A1)
I_ENC_B1: U4.8 U7.7(A4)
I_ENC_B2: U4.12 U7.10(A7)
I_ENC_B3: U5.4 U11.4(A1)
I_ENC_B4: U5.8 U11.7(A4)
I_ENC_B5: U5.12 U11.10(A7)
IMU_RX: H2.3 U1.84  [also labelled PA10, USART1 RX]
IMU_TX: H2.2 U1.49  [also labelled PA9, USART1 TX]
IN_0: U1.68 U8.14(B7)  [also labelled LIMIT 1, P38]
IN_1: U1.67 U8.15(B6)  [also labelled LIMIT 2, P35]
IN_2: U1.66 U8.16(B5)  [also labelled LIMIT 3, P36]
IN_3: U1.65 U8.17(B4)  [also labelled LIMIT 4, P40]
IN_11: U1.9 U9.17(B4)  [also labelled PA3, START]
IN_12: U1.35 U9.18(B3)  [also labelled PA6, STOP]
IN_13: U1.10 U9.19(B2)  [also labelled PA5]
IN_14: U1.23 U9.20(B1)  [also labelled LIMIT 5, P33]
IN_15: U1.22 U9.21(B0)  [also labelled LIMIT 6, P34]
LED ERROR: RN2.2 U1.87 U6.9(A7)  [also labelled OUT_11, PC12]
LED IDLE: RN2.3 U1.47 U6.8(A6)  [also labelled OUT_10, PA15]
LED READY: RN2.4 U1.39 U6.7(A5)  [also labelled OUT_9, PC3]
NRST: C33.1 R26.2 S1.2 U1.6
O_DIR_0: R6.1 U3.16(B2)
O_DIR_1: R21.1 U3.18(B0)
O_DIR_2: R34.1 U10.12(B6)
O_DIR_3: R46.1 U10.14(B4)
O_DIR_4: R56.1 U10.16(B2)
O_DIR_5: R63.1 U10.18(B0)
O_ENC_A0: C7.1 IC1.1(RO) R3.2 U4.1
O_ENC_A1: C27.1 IC4.1(RO) R20.2 U4.5
O_ENC_A2: C46.1 IC6.1(RO) R37.2 U4.11
O_ENC_A3: C63.1 IC10.1(RO) R51.2 U5.1
O_ENC_A4: C87.1 IC13.1(RO) R59.2 U5.5
O_ENC_A5: C96.1 IC15.1(RO) R78.2 U5.11
O_ENC_B0: C20.1 IC3.1(RO) R14.2 U4.3
O_ENC_B1: C39.1 IC5.1(RO) R29.2 U4.9
O_ENC_B2: C54.1 IC8.1(RO) R43.2 U4.13
O_ENC_B3: C77.1 IC12.1(RO) R55.2 U5.3
O_ENC_B4: C92.1 IC14.1(RO) R69.2 U5.9
O_ENC_B5: C100.1 IC16.1(RO) R85.2 U5.13
O_IN_0: C2.2 OP1.4(E) RN3.9 U8.10(A7)
O_IN_1: C12.2 OP4.4(E) RN3.8 U8.9(A6)
O_IN_2: C23.2 OP6.4(E) RN3.7 U8.8(A5)
O_IN_3: C30.2 OP9.4(E) RN3.6 U8.7(A4)
O_IN_4: C35.2 OP11.4(E) RN3.5 U8.6(A3)
O_IN_5: C42.2 OP14.4(E) RN3.4 U8.5(A2)
O_IN_6: C49.2 OP16.4(E) RN3.3 U8.4(A1)
O_IN_7: C58.2 OP19.4(E) RN3.2 U8.3(A0)
O_IN_8: C3.2 OP2.4(E) RN4.9 U9.10(A7)
O_IN_9: C13.2 OP5.4(E) RN4.8 U9.9(A6)
O_IN_10: C24.2 OP7.4(E) RN4.7 U9.8(A5)
O_IN_11: C31.2 OP10.4(E) RN4.6 U9.7(A4)
O_IN_12: C36.2 OP12.4(E) RN4.5 U9.6(A3)
O_IN_13: C43.2 OP15.4(E) RN4.4 U9.5(A2)
O_IN_14: C51.2 OP17.4(E) RN4.3 U9.4(A1)
O_IN_15: C59.2 OP20.4(E) RN4.2 U9.3(A0)
O_OUT_0: D24.1(A) U3.14(B4)
O_OUT_1: D26.1(A) U3.13(B5)
O_OUT_2: D28.1(A) U3.12(B6)
O_OUT_3: D30.1(A) U3.11(B7)
O_OUT_4: D32.1(A) U6.18(B0)
O_OUT_5: D34.1(A) U6.17(B1)
O_OUT_6: R66.2 U6.16(B2)
O_OUT_7: R71.2 U6.15(B3)
O_OUT_8: R76.2 U6.14(B4)
O_OUT_9: R81.2 U6.13(B5)
O_OUT_10: R86.2 U6.12(B6)
O_OUT_11: R91.2 U6.11(B7)
O_PWM_0: R5.1 U3.15(B3)
O_PWM_1: R19.1 U3.17(B1)
O_PWM_2: R32.1 U10.11(B7)
O_PWM_3: R45.1 U10.13(B5)
O_PWM_4: R54.1 U10.15(B3)
O_PWM_5: R61.1 U10.17(B1)
OUT_0: RN1.5 U1.13 U3.6(A4)  [also labelled PB1, RELAY 1]
OUT_1: RN1.4 U1.32 U3.7(A5)  [also labelled PB2, RELAY 2]
OUT_2: RN1.3 U1.11 U3.8(A6)  [also labelled PA7, RELAY 3]
OUT_3: RN1.2 U1.2 U3.9(A7)  [also labelled PB3, RELAY 4]
OUT_4: RN2.9 U1.43 U6.2(A0)  [also labelled PB4, RELAY 5]
OUT_5: RN2.8 U1.3 U6.3(A1)  [also labelled PB5, RELAY 6]
OUT_6: RN2.7 U1.42 U6.4(A2)  [also labelled PB6]
OUT_7: RN2.6 U1.5 U6.5(A3)  [also labelled PE0]
OUT_8: RN2.5 U1.40 U6.6(A4)  [also labelled PE1]
P02: U1.15
P03: U1.30
P04: RN1.6 U1.16 U3.5(A3)  [also labelled PWM_0]
P06: RN1.8 U1.17 U3.3(A1)  [also labelled PWM_1]
P08: RN5.2 U1.18 U10.9(A7)  [also labelled PWM_2]
P16: RN5.4 U1.19 U10.7(A5)  [also labelled PWM_3]
P18: RN5.6 U1.20 U10.5(A3)  [also labelled PWM_4]
P20: RN5.8 U1.21 U10.3(A1)  [also labelled PWM_5]
PA0: U1.38
PA8: U1.83
PA11: U1.48
PA12: U1.85
PB10: H3.2 U1.55  [also labelled PC_TX, USART3 TX]
PB11: H3.3 U1.78  [also labelled PC_RX, USART3 RX]
PC8: U1.82
PC9: U1.50
PD0: U1.56
PD1: U1.77
PD2: U1.57
PD3: U1.76
RS485_A+: HD28.1 IC9.7(A+)
RS485_B-: HD28.2 IC9.6(B-)
RS485_G: HD28.3 IC9.5(GE)
NetC71_2: C71.2 IC11.3(IN+) VR1.2
NetC81_2: C81.2 IC11.5(IN+) VR2.2
NetD1_1: D1.1 F1.2
NetD2_2: D2.2(K) OP1.1(A) R1.1
NetD3_2: D3.2(K) OP2.1(A) R2.1
NetD4_1: D4.1(a) L1.1 U2.2(OUT)
NetD5_2: D5.2(K) OP4.1(A) R9.1
NetD6_2: D6.2(K) OP5.1(A) R10.1
NetD7_1: D7.1(A) R11.2
NetD8_1: D8.1(A) R12.2
NetD9_1: D9.1(A) R13.2
NetD10_2: D10.2(K) OP6.1(A) R15.1
NetD11_2: D11.2(K) OP7.1(A) R16.1
NetD12_2: D12.2(K) OP9.1(A) R23.1
NetD13_2: D13.2(K) OP10.1(A) R24.1
NetD14_2: D14.2(K) OP11.1(A) R27.1
NetD15_2: D15.2(K) OP12.1(A) R28.1
NetD16_2: D16.2(K) OP14.1(A) R33.1
NetD17_2: D17.2(K) OP15.1(A) R35.1
NetD18_2: D18.2(K) OP16.1(A) R41.1
NetD19_2: D19.2(K) OP17.1(A) R42.1
NetD20_2: D20.2(K) OP19.1(A) R47.1
NetD21_2: D21.2(K) OP20.1(A) R48.1
NetD24_2: D24.2(K) R64.2
NetD25_2: D25.2(K) OP24.4(E) R67.1
NetD26_2: D26.2(K) R70.2
NetD27_2: D27.2(K) OP26.4(E) R72.1
NetD28_2: D28.2(K) R75.2
NetD29_2: D29.2(K) OP28.4(E) R77.1
NetD30_2: D30.2(K) R83.2
NetD31_2: D31.2(K) OP29.4(E) R82.1
NetD32_2: D32.2(K) R88.2
NetD33_2: D33.2(K) OP31.4(E) R87.1
NetD34_2: D34.2(K) R93.2
NetD35_2: D35.2(K) OP33.4(E) R92.1
NetF1_1: F1.1 HD3.2
NetOP3_2: OP3.2(C1) R5.2
NetOP3_3: OP3.3(C2) R6.2
NetOP8_2: OP8.2(C1) R19.2
NetOP8_3: OP8.3(C2) R21.2
NetOP13_2: OP13.2(C1) R32.2
NetOP13_3: OP13.3(C2) R34.2
NetOP18_2: OP18.2(C1) R45.2
NetOP18_3: OP18.3(C2) R46.2
NetOP21_2: OP21.2(C1) R54.2
NetOP21_3: OP21.3(C2) R56.2
NetOP22_2: OP22.2(C1) R61.2
NetOP22_3: OP22.3(C2) R63.2
NetOP23_1: OP23.1(A) R64.1
NetOP23_3: OP23.3(C) R68.1
NetOP24_1: OP24.1(A) R66.1
NetOP25_1: OP25.1(A) R70.1
NetOP25_3: OP25.3(C) R74.1
NetOP26_1: OP26.1(A) R71.1
NetOP27_1: OP27.1(A) R75.1
NetOP27_3: OP27.3(C) R79.1
NetOP28_1: OP28.1(A) R76.1
NetOP29_1: OP29.1(A) R81.1
NetOP30_1: OP30.1(A) R83.1
NetOP30_3: OP30.3(C) R84.1
NetOP31_1: OP31.1(A) R86.1
NetOP32_1: OP32.1(A) R88.1
NetOP32_3: OP32.3(C) R89.1
NetOP33_1: OP33.1(A) R91.1
NetOP34_1: OP34.1(A) R93.1
NetOP34_3: OP34.3(C) R94.1
NetQ1_3: Q1.3(E) R68.2
NetQ2_3: Q2.3(E) R74.2
NetQ3_3: Q3.3(E) R79.2
NetQ4_3: Q4.3(E) R84.2
NetQ5_3: Q5.3(E) R89.2
NetQ6_3: Q6.3(E) R94.2

Not connected (* = marked no-connect by the designer): IC1 4(DI)*; IC3 4(DI)*; IC4 4(DI)*; IC5 4(DI)*; IC6 4(DI)*; IC8 4(DI)*; IC10 4(DI)*; IC12 4(DI)*; IC13 4(DI)*; IC14 4(DI)*; IC15 4(DI)*; IC16 4(DI)*; U1 12 52*; U7 5(A2) 8(A5) 16(B5) 19(B2); U11 5(A2) 8(A5) 16(B5) 19(B2)

### Notes on the sheet
- (near U1) STM_CPLD
- INPUT
- POWER
- ENCODER
- PWM
- RESET
- (near IC7) EEPROM
- (near H1) Bluetooth
- Mechanical
- IMU
- RS485
- PC
- ADC
- OUTPUT
- NOTE:
  + Copy ra như sau:
  + Min Line: 10 mil
  + Clearance: 20 mil
  + Via Hole / Pad: 18 mil / 30 mil
- Labels drawn without touching a wire or pin: ADC_3, ADC_4
- Title
- Size:
- Date:
- File:
- A0
- Number:
- Time:
- Revision:
- Sheet
- of
- (in symbol 74LCV4245) VCCA

### Library data of the parts
C1-C4 C6-C9 C11-C14 C16 C18-C65 C67-C70 C72-C74 C76-C78 C80 C82-C101 = CAP_SM_0805: Ceramic Capacitor SMD
C5 C10 = Cap_SM_Alu: SMD Aluminum Electrolytic Capacitor; Size D8: 100uF/35V, 220uF/16V, 330uF/6.3V; Size A: 2.2uF/35V, 3.3uF/35V, 4.7uF/25V; Size D: 47uF/25V, 100uF/16V,; Size C: 33uF/16V; Size B: 1uF/50V, 10uF/16V, 22uF/16V; Size F: 470uF/16V; Size G: 330uF/35V, 680uF/16V, 1000uF/10V
C15 C17 C75 C79 = CP2: C 47uF/50V , 220uF/16V; Value: 47uF/16 - 50V; Description 1: 470uF/6,3V - 330uF/10V - 220uF/16V; Description 2: 100uF/25V - 35V - 47uF/50V - 22uF/100V; Description 3: 33uF => 47uF/63V - 1uF => 4,7uF/160V; Description 4: 1uF => 2,2uF/250V - 1uF/350V
C66 C71 = CN: Value: 0,1uF/300V; Designed by: VanDungEvn
C81 = CN: Ceramic Capacitor SMD; Value: 0,1uF/300V; Designed by: VanDungEvn
D1 = Diode: General Rectifier; Link: http://www.tme.vn/Product.aspx?id=769#page=pro_info
D2 D3 D5-D21 D24-D35 = LED_SMD: LED SMD
D4 = ss34: Surface Mount Schottky Barrier Rectifier
D22 D23 = D Zener: Silicon Planar Zener Diodes
Dr1-Dr4 = Drill 3mm
F1 = Ferrite bead
H1-H3 = Header white 4: Value: Header white 4
HD1-HD3 HD5-HD10 HD12-HD17 HD19-HD23 HD25-HD27 HD29 HD31 HD33 HD35-HD39 HD41-HD44 = Domino 2: Domino 2 200mil; Value: Domino 2
HD4 HD11 HD18 HD24 HD30 HD32 HD34 = Domino 4: Domino 4 200mil; Value: Domino 4
HD28 = Domino 3: Domino 3 200mil; Value: Domino 3
HD40 = Domino 8: Domino 8 200mil; Value: Domino 8
IC1 IC3-IC6 IC8 IC10 IC12-IC16 = MAX485: RS232 - RS485 (Same sn75176)
IC2 = LM1117: Available in 1.8V, 2.5V, 2.85V, 3.3V, 5V, and  Adjustable Versions; Value: LM317
IC7 = 24Cxx: Standard 2-Wire Bus Interface Serial EEPROM; Value: DIP 8; Copyright by: VanDungEvn
IC9 = RS485_Module: Module RS485
IC11 = LM358: Low-Power Dual Operational Amplifier; Value: LM358
L1 = L1: Inductor; Value: 150 mH
OP1 OP2 OP4-OP7 OP9-OP12 OP14-OP17 OP19 OP20 OP23-OP34 = PC817: OPTO
OP3 OP8 OP13 OP18 OP21 OP22 = HCPL2631: High CMR, High Speed TTL Compatible Optocouplers
Q1-Q6 = KSC2383: Bipolar Small Signal NPN Epitaxial Transistor
R1-R94 = Res-SMD: Resistor; Manufacturer: Generic Components; Class: Passive; Published: 08/06/2000; Publisher: Altium Hobart Technology Centre
RN1-RN5 = RN8: Resistor 8 (Thanh); Value: Tro thanh 10K
S1 = SW - 2Pin: Switch button 2 pin
U1 = STM_CPLD_Board: STM32f4 and Max2 570 on one board
U2 = LM2596: SIMPLE SWITCHER® Power Converter 150-kHz - 3A Step-Down Voltage Regulator; Max Input Voltage: 12 V; Max Output Current: 3 (6.0 peak) A; Max Output Voltage: mV; Category: IC-Power; Min Input Voltage: mV; Min Output Voltage: mV; Mounting Technology: Surface Mount; Status: Unreleased; Supply Voltage: mV; Temperature Range: -40 to +125 degC
U3 U6 U10 = 74HC245: Octal bus tranceiver; Link: http://tme.vn/Product.aspx?id=1404#page=pro_info
U4 U5 = 74HC14: Hex Inverters With SCHMITT-TRIGGER Inputs
U7-U9 U11 = 74LCV4245: Octal dual supply translating transceiver; 3-state
VR1 VR2 = VR1: Var Resistor; Value: VR 10K